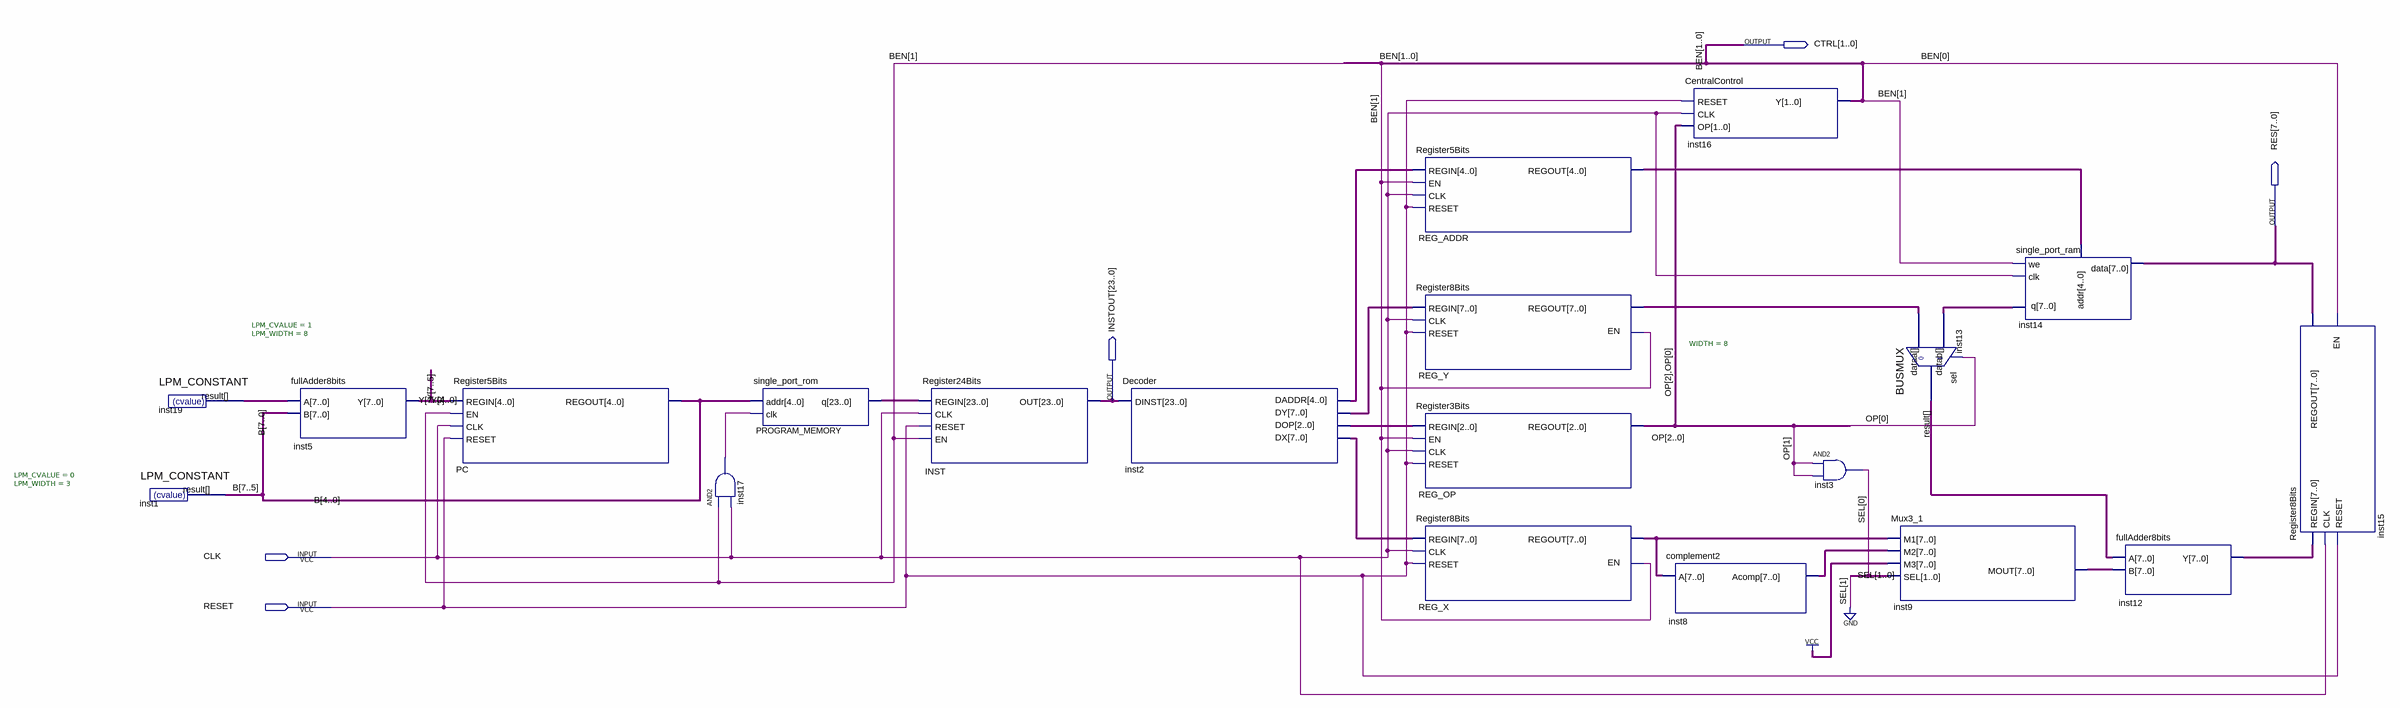
[diagram p0: schematic sheet]
// Quartus schematic MainProcessor.bdf as structural Verilog: 20 symbols, 5 pins
module MainProcessor (
  input  CLK,
  input  RESET,
  output [1:0] CTRL,
  output [7:0] RES,
  output [23:0] INSTOUT
);

  wire inst17_out;
  wire [0:0] SEL;
  wire [2:0] inst2_dop, OP;
  wire [4:0] inst2_daddr, REG_ADDR_regout;
  wire [7:0] B, inst2_dx, inst2_dy, inst8_acomp, inst9_mout, inst12_y, inst13_result, inst14_q,
       inst19_result, REG_X_regout, REG_Y_regout, Y;
  wire [23:0] PROGRAM_MEMORY_q;

  LPM_CONSTANT #(.LPM_CVALUE(1), .LPM_WIDTH(8)) inst19 (.result(inst19_result));
  LPM_CONSTANT #(.LPM_CVALUE(0), .LPM_WIDTH(3)) inst1 (.result(B[7:5]));
  fullAdder8bits inst5 (.A(inst19_result), .B(B), .Y(Y));
  Register5Bits PC (.REGIN(Y[4:0]), .EN(CTRL[1]), .CLK(CLK), .RESET(RESET), .REGOUT(B[4:0]));
  and inst17 (inst17_out, CTRL[1], CLK);
  single_port_rom PROGRAM_MEMORY (.addr(B[4:0]), .clk(inst17_out), .q(PROGRAM_MEMORY_q));
  Register24Bits INST (.REGIN(PROGRAM_MEMORY_q), .CLK(CLK), .RESET(RESET), .EN(CTRL[1]), .OUT(INSTOUT));
  Decoder inst2 (.DINST(INSTOUT), .DADDR(inst2_daddr), .DY(inst2_dy), .DOP(inst2_dop), .DX(inst2_dx));
  Register5Bits REG_ADDR (.REGIN(inst2_daddr), .EN(CTRL[1]), .CLK(CLK), .RESET(RESET), .REGOUT(REG_ADDR_regout));
  Register8Bits REG_Y (.REGIN(inst2_dy), .EN(CTRL[1]), .CLK(CLK), .RESET(RESET), .REGOUT(REG_Y_regout));
  Register3Bits REG_OP (.REGIN(inst2_dop), .EN(CTRL[1]), .CLK(CLK), .RESET(RESET), .REGOUT(OP));
  Register8Bits REG_X (.REGIN(inst2_dx), .EN(CTRL[1]), .CLK(CLK), .RESET(RESET), .REGOUT(REG_X_regout));
  complement2 inst8 (.A(REG_X_regout), .Acomp(inst8_acomp));
  CentralControl inst16 (.RESET(RESET), .CLK(CLK), .OP({OP[2], OP[0]}), .Y(CTRL));
  and inst3 (SEL[0], OP[1], OP[1]);
  BUSMUX #(.WIDTH(8)) inst13 (.datab(inst14_q), .sel(OP[0]), .dataa(REG_Y_regout), .result(inst13_result));
  Mux3_1 inst9 (.M1(REG_X_regout), .M2(inst8_acomp), .M3({8{1'b1}}), .SEL({1'b0, SEL[0]}), .MOUT(inst9_mout));
  single_port_ram inst14 (.data(RES), .addr(REG_ADDR_regout), .we(CTRL[1]), .clk(CLK), .q(inst14_q));
  fullAdder8bits inst12 (.A(inst13_result), .B(inst9_mout), .Y(inst12_y));
  Register8Bits inst15 (.REGIN(inst12_y), .EN(CTRL[0]), .CLK(CLK), .RESET(RESET), .REGOUT(RES));

  // Other names for the same wires on the sheet: BEN[1:0] = CTRL
endmodule
